# EasyEDA Pro project ProDoc_T527 LPDDR4 4层 模板_2024-06-06.epro, schematic T527 LPDDR4 4层 模板
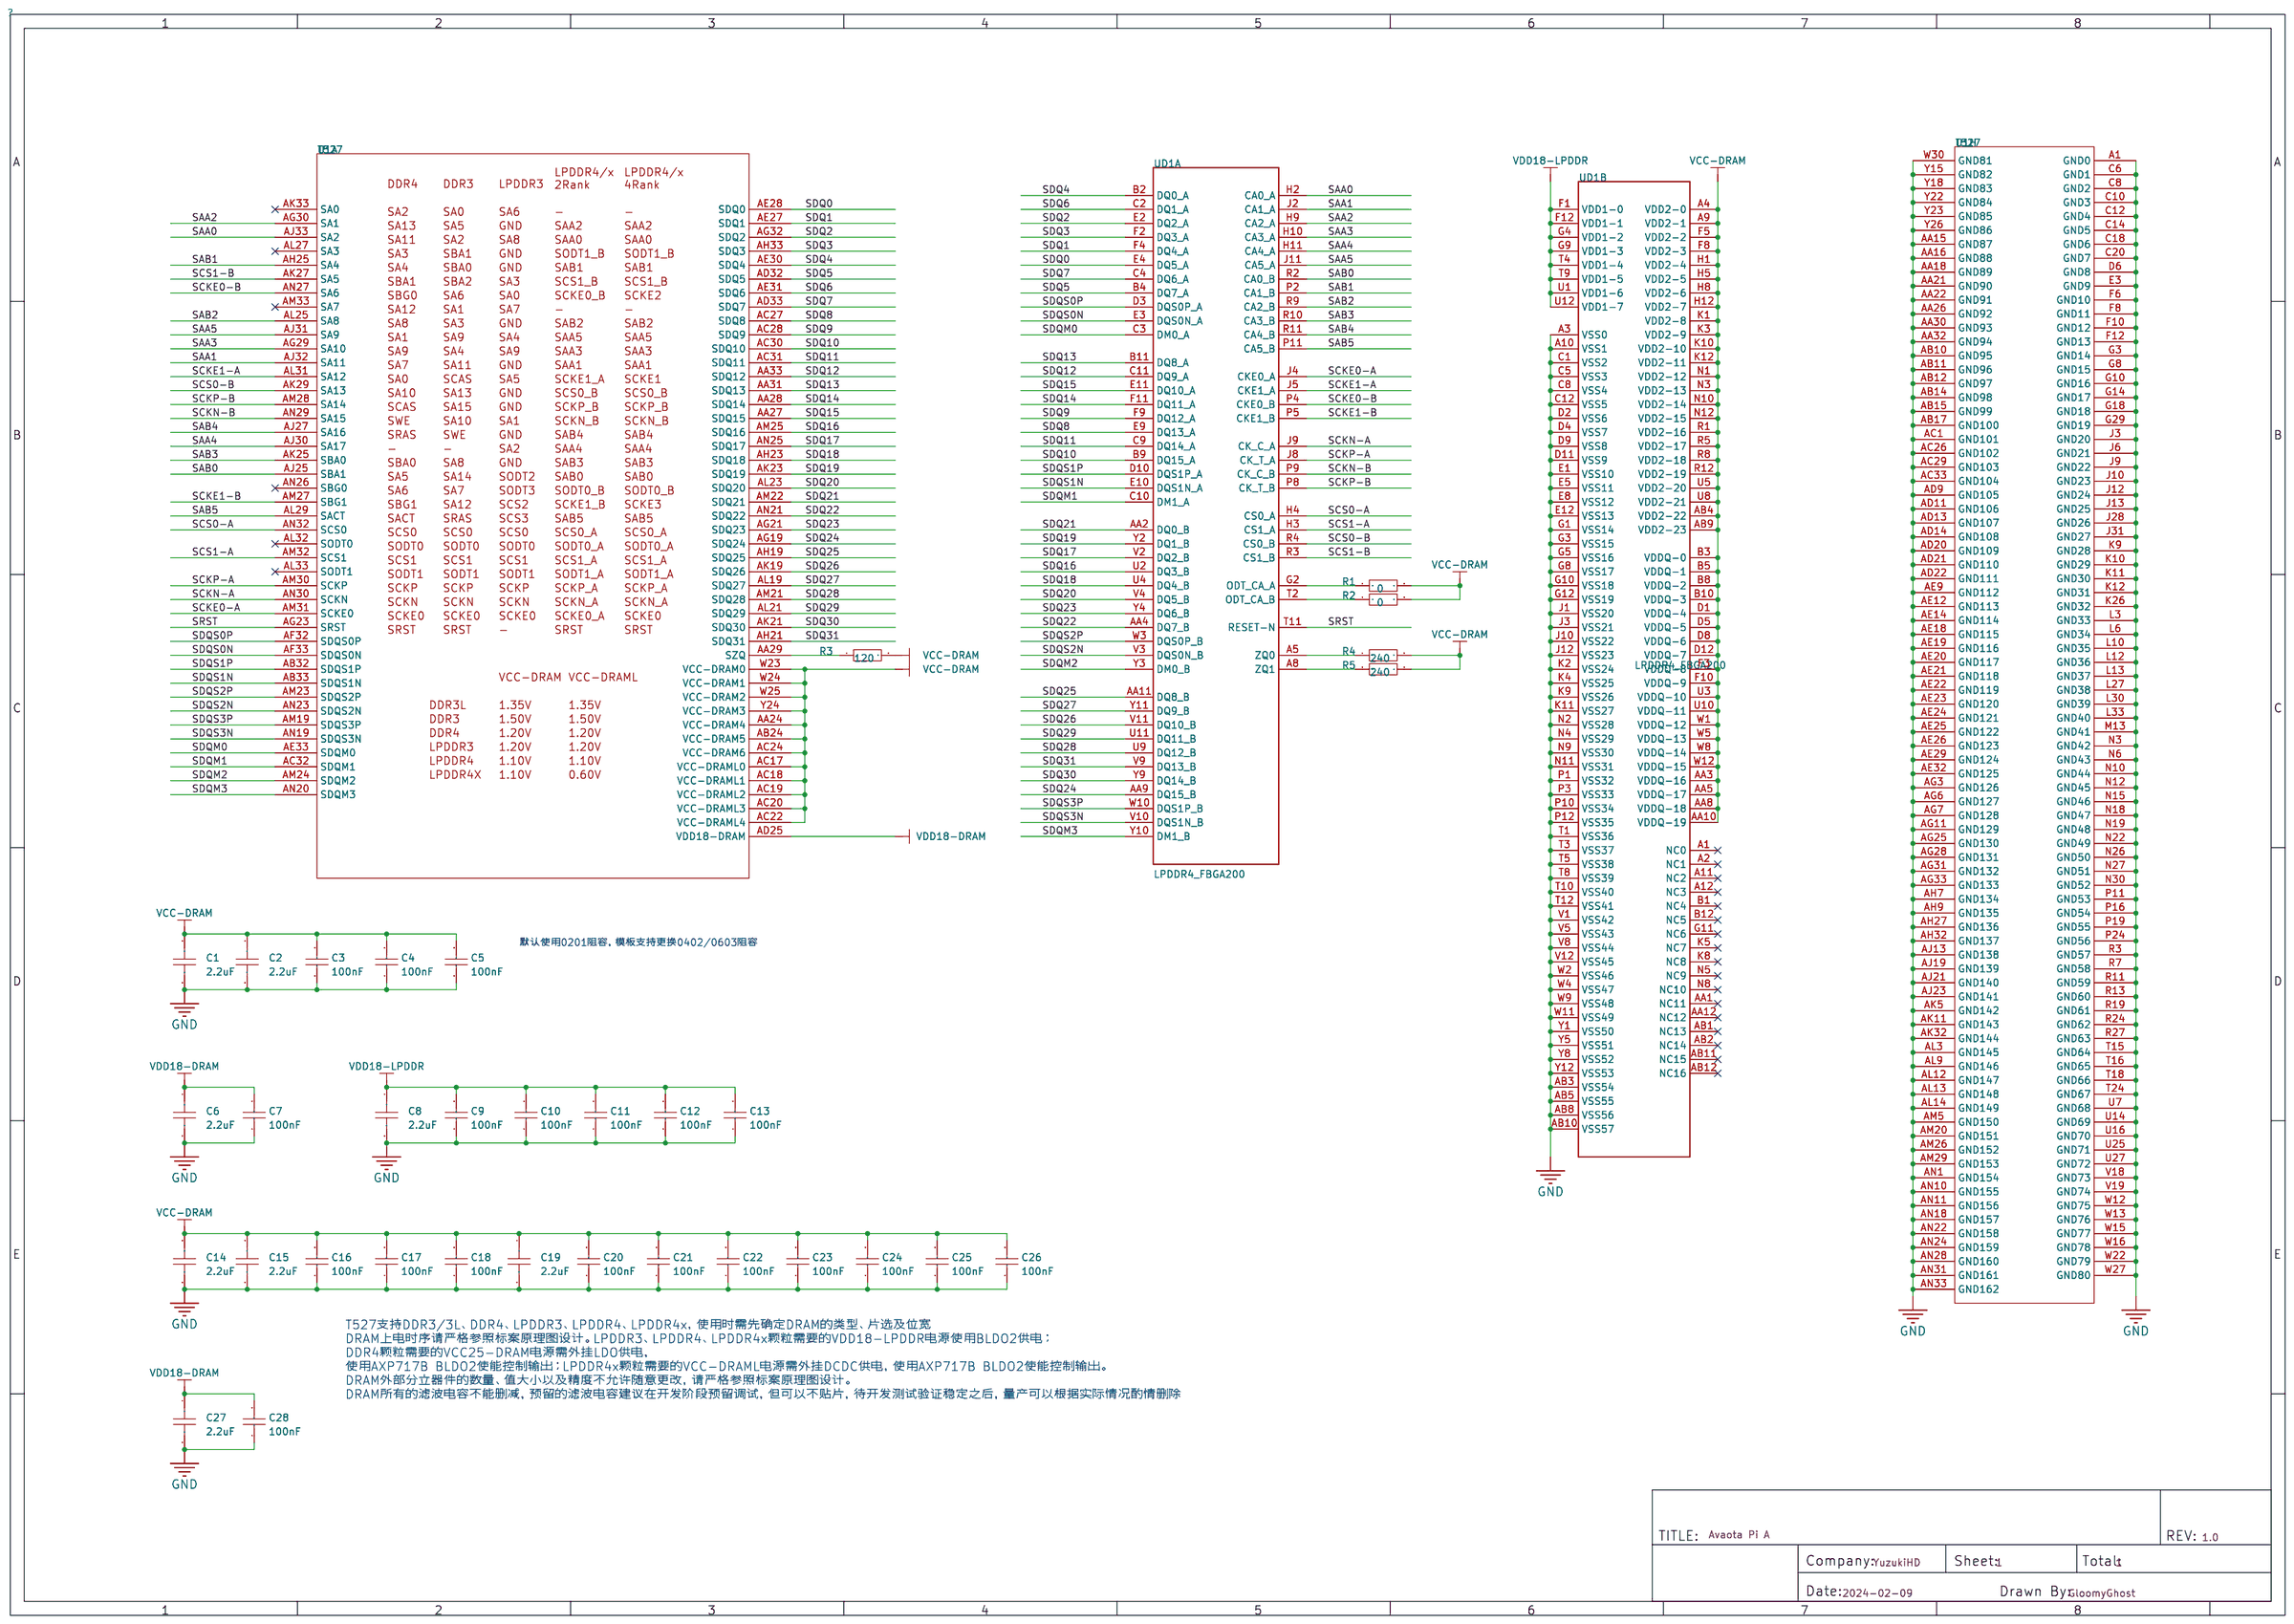
[diagram p0: schematic sheet]

## Parts
C1  2.2uF  [c0201 nsk]
C2  2.2uF  [c0201 nsk]
C3  100nF  [c0201 nsk]
C4  100nF  [c0201 nsk]
C5  100nF  [c0201 nsk]
C6  2.2uF  [c0201 nsk]
C7  100nF  [c0201 nsk]
C8  2.2uF  [c0201 nsk]
C9  100nF  [c0201 nsk]
C10  100nF  [c0201 nsk]
C11  100nF  [c0201 nsk]
C12  100nF  [c0201 nsk]
C13  100nF  [c0201 nsk]
C14  2.2uF  [c0201 nsk]
C15  2.2uF  [c0201 nsk]
C16  100nF  [c0201 nsk]
C17  100nF  [c0201 nsk]
C18  100nF  [c0201 nsk]
C19  2.2uF  [c0201 nsk]
C20  100nF  [c0201 nsk]
C21  100nF  [c0201 nsk]
C22  100nF  [c0201 nsk]
C23  100nF  [c0201 nsk]
C24  100nF  [c0201 nsk]
C25  100nF  [c0201 nsk]
C26  100nF  [c0201 nsk]
C27  2.2uF  [c0201 nsk]
C28  100nF  [c0201 nsk]
R1  0  [r0201 nsk]
R2  0  [r0201 nsk]
R3  120  [r0201 nsk]
R4  240  [r0201 nsk]
R5  240  [r0201 nsk]
U1  T527  [T527-BGA664]  (sections DRAM,GND)
UD1  LPDDR4_FBGA200  [BGA200P65_80B1000_1500H90]  (sections 1,2)

## Library data of the parts
C1 C2 C6 C8 C14 C15 C19 C27 = 0201X225M6R3NT: 容值:2.2uF;精度:±20%;额定电压:6.3V;材质(温度系数):X5R;; LCSC Part Name: 2.2uF ±20% 6.3V; Supplier Part: C285111; Manufacturer: FH(风华); Supplier Footprint: 0201; JLCPCB Part Class: 扩展库; Datasheet: https://atta.szlcsc.com/upload/public/pdf/source/20180913/C285111_405173511BA094D64E8CAA96F7E40A73.pdf; Supplier: LCSC; Tolerance: ±20%; Voltage Rated: 6.3V; Temperature Coefficient: X5R
C3-C5 C7 C9-C13 C16-C18 C20-C26 C28 = GRM033R61A104KE15D: 容值:100nF;精度:±10%;额定电压:10V;材质(温度系数):X5R;; LCSC Part Name: 100nF ±10% 10V; Supplier Part: C76934; Manufacturer: muRata(村田); Supplier Footprint: 0201; JLCPCB Part Class: Extended Part; Datasheet: https://atta.szlcsc.com/upload/public/pdf/source/20180307/C76934_15204090982891407723.pdf; Supplier: LCSC; Tolerance: ±10%; Voltage Rated: 10V; Temperature Coefficient: X5R
R1-R5 = Res_0201: Supplier Footprint: 0201
U1 = T527: Allwinner T527 SoC; SWAP_INFO: (S1+S2+S3+S4+S5+S6+S7+S8+S9); SPLIT_INST: TRUE
UD1 = LPDDR4_FBGA200: SWAP_INFO: (S1+S2); SPLIT_INST: TRUE

## Nets
GND: C1.2 C2.2 C3.1 C4.1 C5.1 C6.2 C7.1 C8.2 C9.1 C10.1 C11.1 C12.1 C13.1 C14.2 C15.2 C16.1 C17.1 C18.1 C19.2 C20.1 C21.1 C22.1 C23.1 C24.1 C25.1 C26.1 C27.2 C28.1 U1.A1(GND0) U1.AA15(GND87) U1.AA16(GND88) U1.AA18(GND89) U1.AA21(GND90) U1.AA22(GND91) U1.AA26(GND92) U1.AA30(GND93) U1.AA32(GND94) U1.AB10(GND95) U1.AB11(GND96) U1.AB12(GND97) U1.AB14(GND98) U1.AB15(GND99) U1.AB17(GND100) U1.AC1(GND101) U1.AC26(GND102) U1.AC29(GND103) U1.AC33(GND104) U1.AD9(GND105) U1.AD11(GND106) U1.AD13(GND107) U1.AD14(GND108) U1.AD20(GND109) U1.AD21(GND110) U1.AD22(GND111) U1.AE9(GND112) U1.AE12(GND113) U1.AE14(GND114) U1.AE18(GND115) U1.AE19(GND116) U1.AE20(GND117) U1.AE21(GND118) U1.AE22(GND119) U1.AE23(GND120) U1.AE24(GND121) U1.AE25(GND122) U1.AE26(GND123) U1.AE29(GND124) U1.AE32(GND125) U1.AG3(GND126) U1.AG6(GND127) U1.AG7(GND128) U1.AG11(GND129) U1.AG25(GND130) U1.AG28(GND131) U1.AG31(GND132) U1.AG33(GND133) U1.AH7(GND134) U1.AH9(GND135) U1.AH27(GND136) U1.AH32(GND137) U1.AJ13(GND138) U1.AJ19(GND139) U1.AJ21(GND140) U1.AJ23(GND141) U1.AK5(GND142) U1.AK11(GND143) U1.AK32(GND144) U1.AL3(GND145) U1.AL9(GND146) U1.AL12(GND147) U1.AL13(GND148) U1.AL14(GND149) U1.AM5(GND150) U1.AM20(GND151) U1.AM26(GND152) U1.AM29(GND153) U1.AN1(GND154) U1.AN10(GND155) U1.AN11(GND156) U1.AN18(GND157) U1.AN22(GND158) U1.AN24(GND159) U1.AN28(GND160) U1.AN31(GND161) U1.AN33(GND162) U1.C6(GND1) U1.C8(GND2) U1.C10(GND3) U1.C12(GND4) U1.C14(GND5) U1.C18(GND6) U1.C20(GND7) U1.D6(GND8) U1.E3(GND9) U1.F6(GND10) U1.F8(GND11) U1.F10(GND12) U1.F12(GND13) U1.G3(GND14) U1.G8(GND15) U1.G10(GND16) U1.G14(GND17) U1.G18(GND18) U1.G29(GND19) U1.J3(GND20) U1.J6(GND21) U1.J9(GND22) U1.J10(GND23) U1.J12(GND24) U1.J13(GND25) U1.J28(GND26) U1.J31(GND27) U1.K9(GND28) U1.K10(GND29) U1.K11(GND30) U1.K12(GND31) U1.K26(GND32) U1.L3(GND33) U1.L6(GND34) U1.L10(GND35) U1.L12(GND36) U1.L13(GND37) U1.L27(GND38) U1.L30(GND39) U1.L33(GND40) U1.M13(GND41) U1.N3(GND42) U1.N6(GND43) U1.N10(GND44) U1.N12(GND45) U1.N15(GND46) U1.N18(GND47) U1.N19(GND48) U1.N22(GND49) U1.N26(GND50) U1.N27(GND51) U1.N30(GND52) U1.P11(GND53) U1.P16(GND54) U1.P19(GND55) U1.P24(GND56) U1.R3(GND57) U1.R7(GND58) U1.R11(GND59) U1.R13(GND60) U1.R19(GND61) U1.R24(GND62) U1.R27(GND63) U1.T15(GND64) U1.T16(GND65) U1.T18(GND66) U1.T24(GND67) U1.U7(GND68) U1.U14(GND69) U1.U16(GND70) U1.U25(GND71) U1.U27(GND72) U1.V18(GND73) U1.V19(GND74) U1.W12(GND75) U1.W13(GND76) U1.W15(GND77) U1.W16(GND78) U1.W22(GND79) U1.W27(GND80) U1.W30(GND81) U1.Y15(GND82) U1.Y18(GND83) U1.Y22(GND84) U1.Y23(GND85) U1.Y26(GND86) UD1.A3(VSS0) UD1.A10(VSS1) UD1.AB3(VSS54) UD1.AB5(VSS55) UD1.AB8(VSS56) UD1.AB10(VSS57) UD1.C1(VSS2) UD1.C5(VSS3) UD1.C8(VSS4) UD1.C12(VSS5) UD1.D2(VSS6) UD1.D4(VSS7) UD1.D9(VSS8) UD1.D11(VSS9) UD1.E1(VSS10) UD1.E5(VSS11) UD1.E8(VSS12) UD1.E12(VSS13) UD1.G1(VSS14) UD1.G3(VSS15) UD1.G5(VSS16) UD1.G8(VSS17) UD1.G10(VSS18) UD1.G12(VSS19) UD1.J1(VSS20) UD1.J3(VSS21) UD1.J10(VSS22) UD1.J12(VSS23) UD1.K2(VSS24) UD1.K4(VSS25) UD1.K9(VSS26) UD1.K11(VSS27) UD1.N2(VSS28) UD1.N4(VSS29) UD1.N9(VSS30) UD1.N11(VSS31) UD1.P1(VSS32) UD1.P3(VSS33) UD1.P10(VSS34) UD1.P12(VSS35) UD1.T1(VSS36) UD1.T3(VSS37) UD1.T5(VSS38) UD1.T8(VSS39) UD1.T10(VSS40) UD1.T12(VSS41) UD1.V1(VSS42) UD1.V5(VSS43) UD1.V8(VSS44) UD1.V12(VSS45) UD1.W2(VSS46) UD1.W4(VSS47) UD1.W9(VSS48) UD1.W11(VSS49) UD1.Y1(VSS50) UD1.Y5(VSS51) UD1.Y8(VSS52) UD1.Y12(VSS53)
VCC-DRAM: C1.1 C2.1 C3.2 C4.2 C5.2 C14.1 C15.1 C16.2 C17.2 C18.2 C19.1 C20.2 C21.2 C22.2 C23.2 C24.2 C25.2 C26.2 R1.2 R2.2 R3.2 R4.2 R5.2 U1.AA24(VCC-DRAM4) U1.AB24(VCC-DRAM5) U1.AC17(VCC-DRAML0) U1.AC18(VCC-DRAML1) U1.AC19(VCC-DRAML2) U1.AC20(VCC-DRAML3) U1.AC22(VCC-DRAML4) U1.AC24(VCC-DRAM6) U1.W23(VCC-DRAM0) U1.W24(VCC-DRAM1) U1.W25(VCC-DRAM2) U1.Y24(VCC-DRAM3) UD1.A4(VDD2-0) UD1.A9(VDD2-1) UD1.AA3(VDDQ-16) UD1.AA5(VDDQ-17) UD1.AA8(VDDQ-18) UD1.AA10(VDDQ-19) UD1.AB4(VDD2-22) UD1.AB9(VDD2-23) UD1.B3(VDDQ-0) UD1.B5(VDDQ-1) UD1.B8(VDDQ-2) UD1.B10(VDDQ-3) UD1.D1(VDDQ-4) UD1.D5(VDDQ-5) UD1.D8(VDDQ-6) UD1.D12(VDDQ-7) UD1.F3(VDDQ-8) UD1.F5(VDD2-2) UD1.F8(VDD2-3) UD1.F10(VDDQ-9) UD1.H1(VDD2-4) UD1.H5(VDD2-5) UD1.H8(VDD2-6) UD1.H12(VDD2-7) UD1.K1(VDD2-8) UD1.K3(VDD2-9) UD1.K10(VDD2-10) UD1.K12(VDD2-11) UD1.N1(VDD2-12) UD1.N3(VDD2-13) UD1.N10(VDD2-14) UD1.N12(VDD2-15) UD1.R1(VDD2-16) UD1.R5(VDD2-17) UD1.R8(VDD2-18) UD1.R12(VDD2-19) UD1.U3(VDDQ-10) UD1.U5(VDD2-20) UD1.U8(VDD2-21) UD1.U10(VDDQ-11) UD1.W1(VDDQ-12) UD1.W5(VDDQ-13) UD1.W8(VDDQ-14) UD1.W12(VDDQ-15)
VDD18-DRAM: C6.1 C7.2 C27.1 C28.2 U1.AD25(VDD18-DRAM)
VDD18-LPDDR: C8.1 C9.2 C10.2 C11.2 C12.2 C13.2 UD1.F1(VDD1-0) UD1.F12(VDD1-1) UD1.G4(VDD1-2) UD1.G9(VDD1-3) UD1.T4(VDD1-4) UD1.T9(VDD1-5) UD1.U1(VDD1-6) UD1.U12(VDD1-7)
SAA0: U1.AJ33(SA2) UD1.H2(CA0_A)
SAA1: U1.AJ32(SA11) UD1.J2(CA1_A)
SAA2: U1.AG30(SA1) UD1.H9(CA2_A)
SAA3: U1.AG29(SA10) UD1.H10(CA3_A)
SAA4: U1.AJ30(SA17) UD1.H11(CA4_A)
SAA5: U1.AJ31(SA9) UD1.J11(CA5_A)
SAB0: U1.AJ25(SBA1) UD1.R2(CA0_B)
SAB1: U1.AH25(SA4) UD1.P2(CA1_B)
SAB2: U1.AL25(SA8) UD1.R9(CA2_B)
SAB3: U1.AK25(SBA0) UD1.R10(CA3_B)
SAB4: U1.AJ27(SA16) UD1.R11(CA4_B)
SAB5: U1.AL29(SACT) UD1.P11(CA5_B)
SCKE0-A: U1.AM31(SCKE0) UD1.J4(CKE0_A)
SCKE0-B: U1.AN27(SA6) UD1.P4(CKE0_B)
SCKE1-A: U1.AL31(SA12) UD1.J5(CKE1_A)
SCKE1-B: U1.AM27(SBG1) UD1.P5(CKE1_B)
SCKN-A: U1.AN30(SCKN) UD1.J9(CK_C_A)
SCKN-B: U1.AN29(SA15) UD1.P9(CK_C_B)
SCKP-A: U1.AM30(SCKP) UD1.J8(CK_T_A)
SCKP-B: U1.AM28(SA14) UD1.P8(CK_T_B)
SCS0-A: U1.AN32(SCS0) UD1.H4(CS0_A)
SCS0-B: U1.AK29(SA13) UD1.R4(CS0_B)
SCS1-A: U1.AM32(SCS1) UD1.H3(CS1_A)
SCS1-B: U1.AK27(SA5) UD1.R3(CS1_B)
SDQ0: U1.AE28(SDQ0) UD1.E4(DQ5_A)
SDQ1: U1.AE27(SDQ1) UD1.F4(DQ4_A)
SDQ2: U1.AG32(SDQ2) UD1.E2(DQ2_A)
SDQ3: U1.AH33(SDQ3) UD1.F2(DQ3_A)
SDQ4: U1.AE30(SDQ4) UD1.B2(DQ0_A)
SDQ5: U1.AD32(SDQ5) UD1.B4(DQ7_A)
SDQ6: U1.AE31(SDQ6) UD1.C2(DQ1_A)
SDQ7: U1.AD33(SDQ7) UD1.C4(DQ6_A)
SDQ8: U1.AC27(SDQ8) UD1.E9(DQ13_A)
SDQ9: U1.AC28(SDQ9) UD1.F9(DQ12_A)
SDQ10: U1.AC30(SDQ10) UD1.B9(DQ15_A)
SDQ11: U1.AC31(SDQ11) UD1.C9(DQ14_A)
SDQ12: U1.AA33(SDQ12) UD1.C11(DQ9_A)
SDQ13: U1.AA31(SDQ13) UD1.B11(DQ8_A)
SDQ14: U1.AA28(SDQ14) UD1.F11(DQ11_A)
SDQ15: U1.AA27(SDQ15) UD1.E11(DQ10_A)
SDQ16: U1.AM25(SDQ16) UD1.U2(DQ3_B)
SDQ17: U1.AN25(SDQ17) UD1.V2(DQ2_B)
SDQ18: U1.AH23(SDQ18) UD1.U4(DQ4_B)
SDQ19: U1.AK23(SDQ19) UD1.Y2(DQ1_B)
SDQ20: U1.AL23(SDQ20) UD1.V4(DQ5_B)
SDQ21: U1.AM22(SDQ21) UD1.AA2(DQ0_B)
SDQ22: U1.AN21(SDQ22) UD1.AA4(DQ7_B)
SDQ23: U1.AG21(SDQ23) UD1.Y4(DQ6_B)
SDQ24: U1.AG19(SDQ24) UD1.AA9(DQ15_B)
SDQ25: U1.AH19(SDQ25) UD1.AA11(DQ8_B)
SDQ26: U1.AK19(SDQ26) UD1.V11(DQ10_B)
SDQ27: U1.AL19(SDQ27) UD1.Y11(DQ9_B)
SDQ28: U1.AM21(SDQ28) UD1.U9(DQ12_B)
SDQ29: U1.AL21(SDQ29) UD1.U11(DQ11_B)
SDQ30: U1.AK21(SDQ30) UD1.Y9(DQ14_B)
SDQ31: U1.AH21(SDQ31) UD1.V9(DQ13_B)
SDQM0: U1.AE33(SDQM0) UD1.C3(DM0_A)
SDQM1: U1.AC32(SDQM1) UD1.C10(DM1_A)
SDQM2: U1.AM24(SDQM2) UD1.Y3(DM0_B)
SDQM3: U1.AN20(SDQM3) UD1.Y10(DM1_B)
SDQS0N: U1.AF33(SDQS0N) UD1.E3(DQS0N_A)
SDQS0P: U1.AF32(SDQS0P) UD1.D3(DQS0P_A)
SDQS1N: U1.AB33(SDQS1N) UD1.E10(DQS1N_A)
SDQS1P: U1.AB32(SDQS1P) UD1.D10(DQS1P_A)
SDQS2N: U1.AN23(SDQS2N) UD1.V3(DQS0N_B)
SDQS2P: U1.AM23(SDQS2P) UD1.W3(DQS0P_B)
SDQS3N: U1.AN19(SDQS3N) UD1.V10(DQS1N_B)
SDQS3P: U1.AM19(SDQS3P) UD1.W10(DQS1P_B)
SRST: U1.AG23(SRST) UD1.T11(RESET-N)
$2N2017: R3.1 U1.AA29(SZQ)
$2N2070: R4.1 UD1.A5(ZQ0)
$2N2072: R5.1 UD1.A8(ZQ1)
$2N2081: R1.1 UD1.G2(ODT_CA_A)
$2N2083: R2.1 UD1.T2(ODT_CA_B)

Not connected (* = marked no-connect by the designer): U1 AK33(SA0)* AL27(SA3)* AL32(SODT0)* AL33(SODT1)* AM33(SA7)* AN26(SBG0)*; UD1 A1(NC0)* A2(NC1)* A11(NC2)* A12(NC3)* AA1(NC11)* AA12(NC12)* AB1(NC13)* AB2(NC14)* AB11(NC15)* AB12(NC16)* B1(NC4)* B12(NC5)* G11(NC6)* K5(NC7)* K8(NC8)* N5(NC9)* N8(NC10)*

## Notes on the sheet
- 默认使用0201阻容，模板支持更换0402/0603阻容
- T527支持DDR3/3L、DDR4、LPDDR3、LPDDR4、LPDDR4x，使用时需先确定DRAM的类型、片选及位宽
  DRAM上电时序请严格参照标案原理图设计。LPDDR3、LPDDR4、LPDDR4x颗粒需要的VDD18-LPDDR电源使用BLDO2供电；
  DDR4颗粒需要的VCC25-DRAM电源需外挂LDO供电，
  使用AXP717B BLDO2使能控制输出；LPDDR4x颗粒需要的VCC-DRAML电源需外挂DCDC供电，使用AXP717B BLDO2使能控制输出。
  DRAM外部分立器件的数量、值大小以及精度不允许随意更改，请严格参照标案原理图设计。
  DRAM所有的滤波电容不能删减，预留的滤波电容建议在开发阶段预留调试，但可以不贴片，待开发测试验证稳定之后，量产可以根据实际情况酌情删除
